# EAGLE design garden (EAGLE 9.3.2)
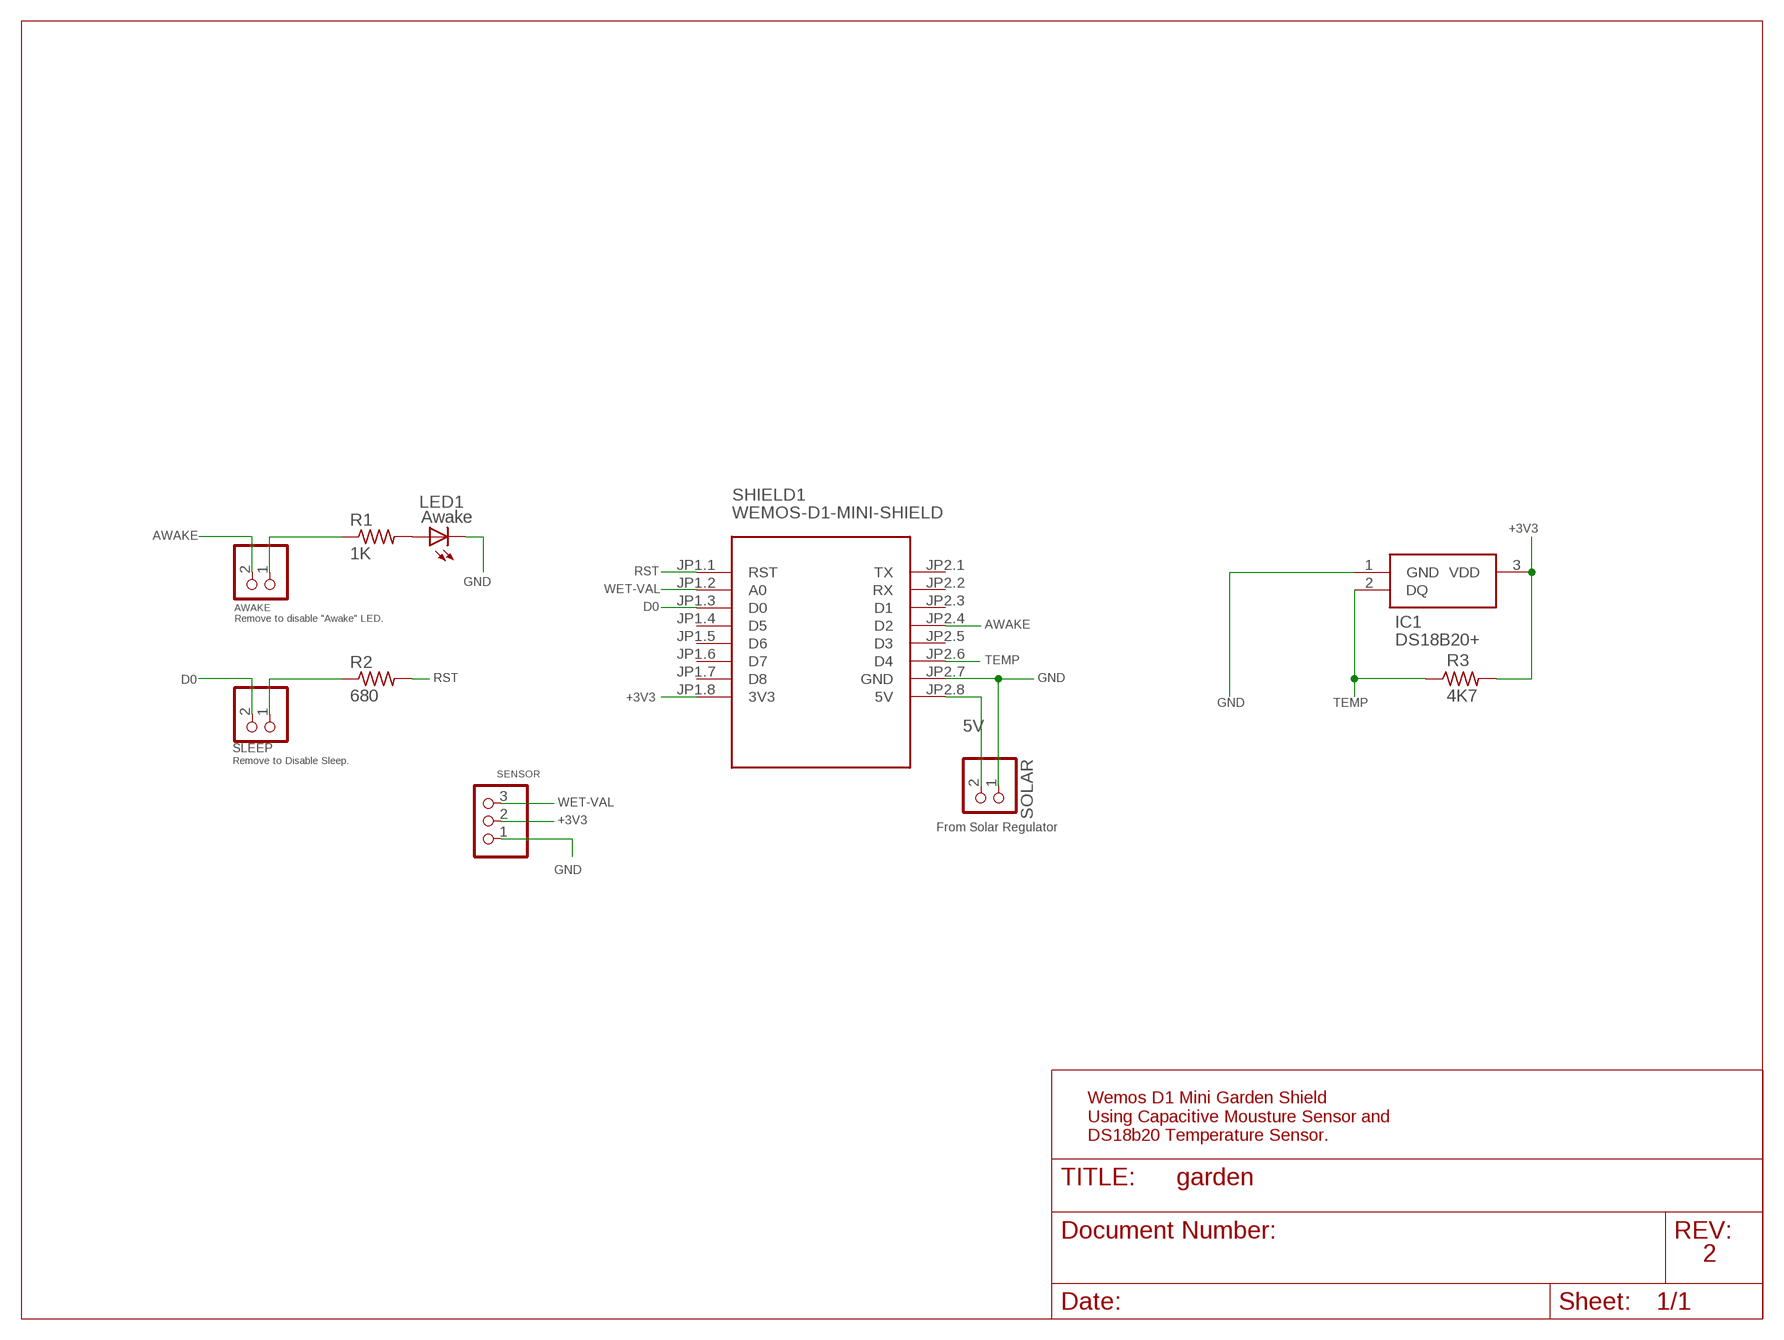
[diagram p0: schematic, sheet 1]

## Parts
AWAKE  Remove to disable "Awake" LED.  PINHD-1X2  [1X02]
IC1  DS18B20+  [TO-92]
LED1  Awake  LED3MM  [LED3MM]
R1  1K  R-US_0207/9  [0207/9]
R2  680  R-US_0207/9  [0207/9]
R3  4K7  R-US_0207/9  [0207/9]
SENSOR  Moisture Sensor  PINHD-1X3/90  [1X03/90]
SHIELD1  WEMOS-D1-MINI-SHIELD  [WEMOS-D1-MINI-SHIELD]
SLEEP  Remove to Disable Sleep.  PINHD-1X2  [1X02]
SOLAR  From Solar Regulator  PINHD-1X2/90  [1X02/90]

## Nets
5V: SHIELD1.JP2.8(5V) SOLAR.2
+3V3: IC1.3(VDD) R3.2 SENSOR.2 SHIELD1.JP1.8(3V3)
AWAKE: AWAKE.2 SHIELD1.JP2.4(D2)
D0: SHIELD1.JP1.3(D0) SLEEP.2
GND: IC1.1(GND) LED1.K(C) SENSOR.1 SHIELD1.JP2.7(GND) SOLAR.1
N$1: LED1.A R1.2
N$4: AWAKE.1 R1.1
N$6: R2.1 SLEEP.1
RST: R2.2 SHIELD1.JP1.1(RST)
TEMP: IC1.2(DQ) R3.1 SHIELD1.JP2.6(D4)
WET-VAL: SENSOR.3 SHIELD1.JP1.2(A0)
Unconnected: SHIELD1.JP1.4(D5) SHIELD1.JP1.5(D6) SHIELD1.JP1.6(D7) SHIELD1.JP1.7(D8) SHIELD1.JP2.1(TX) SHIELD1.JP2.2(RX) SHIELD1.JP2.3(D1) SHIELD1.JP2.5(D3)

## Notes on the sheet
- Wemos D1 Mini Garden Shield
  Using Capacitive Mousture Sensor and
  DS18b20 Temperature Sensor.
- 2

## Library data of the parts
AWAKE SLEEP SOLAR = DC_LOAD_AU:PINHD-1X2: PIN HEADER
IC1 = SamacSys_Parts:DS18B20+: DS18B20 prog thermometer 1-Wire, TO92 Source: Datasheet <https://componentsearchengine.com/Datasheets/1/DS18B20 .pdf>; DESCRIPTION: DS18B20 prog thermometer 1-Wire, TO92; HEIGHT: mm; MANUFACTURER_NAME: Maxim Integrated; MANUFACTURER_PART_NUMBER: DS18B20+; MOUSER_PART_NUMBER: 700-DS18B20+; MOUSER_PRICE-STOCK: https://www.mouser.com/Search/Refine.aspx?Keyword=700-DS18B20%2B
LED1 = adafruit:LED: LED OSRAM: - CHIPLED LG R971, LG N971, LY N971, LG Q971, LY Q971, LO R971, LY R971 LH N974, LH R974 LS Q976, LO Q976, LY Q976 LO Q996 - Hyper CHIPLED LW Q18S LB Q993, LB Q99A, LB R99A - SideLED LS A670, LO A670, LY A670, LG A670, LP A670 LB A673, LV A673, LT A673, LW A673 LH A674 LY A675 LS A676, LA A676, LO A676, LY A676, LW A676 LS A679, LY A679, LG A679 - Hyper Micro SIDELED® LS Y876, LA Y876, LO Y876, LY Y876 LT Y87S - SmartLED LW L88C, LW L88S LB L89C, LB L89S, LG L890 LS L89K, LO L89K, LY L89K LS L896, LA L896, LO L896, LY L896 - TOPLED LS T670, LO T670, LY T670, LG T670, LP T670 LSG T670, LSP T670, LSY T670, LOP T670, LYG T670 LG T671, LOG T671, LSG T671 LB T673, LV T673, LT T673, LW T673 LH T674 LS T676, LA T676, LO T676, LY T676, LB T676, LH T676, LSB T676, LW T676 LB T67C, LV T67C, LT T67C, LS T67K, LO T67K, LY T67K, LW E67C LS E67B, LA E67B, LO E67B, LY E67B, LB E67C, LV E67C, LT E67C LW T67C LS T679, LY T679, LG T679 LS T770, LO T770, LY T770, LG T770, LP T770 LB T773, LV T773, LT T773, LW T773 LH T774 LS E675, LA E675, LY E675, LS T675 LS T776, LA T776, LO T776, LY T776, LB T776 LHGB T686 LT T68C, LB T68C - Hyper Mini TOPLED® LB M676 - Mini TOPLED Santana® LG M470 LS M47K, LO M47K, LY M47K Source: http://www.osram.convergy.de/
R1-R3 = adafruit:R-US_: RESISTOR, American symbol
SENSOR = pinhead:PINHD-1X3: PIN HEADER
SHIELD1 = diy-modules:WEMOS-D1-MINI-SHIELD: Template for WEMOS D1 mini compatible shields NOTICE: This is a template only. You can use it as a base to create symbols for WEMOS D1 mini compatible shields. Official list of available shields can be found here: https://www.wemos.cc/D1-mini-Shields

## Board
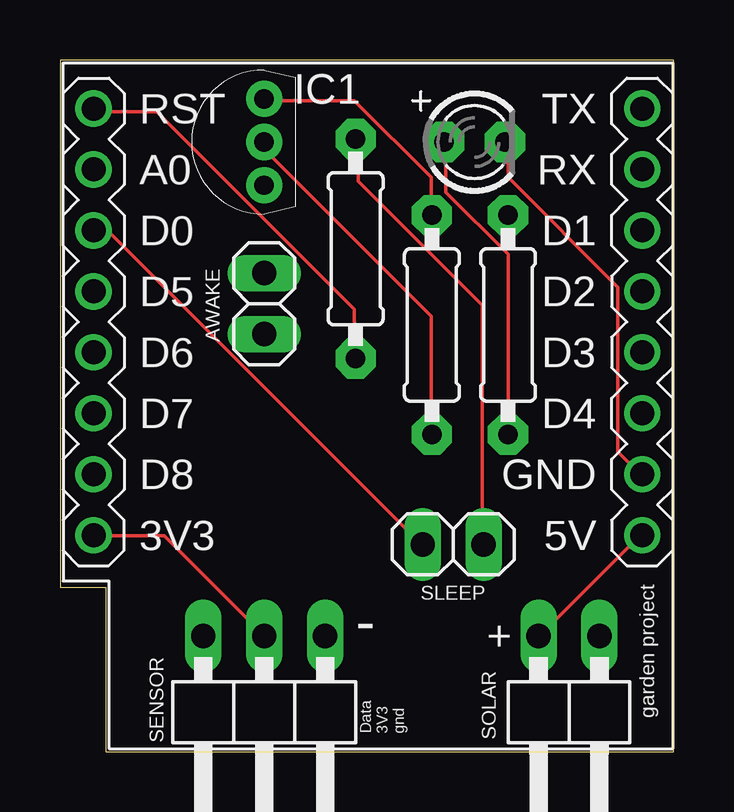
[diagram p1: board, top side]
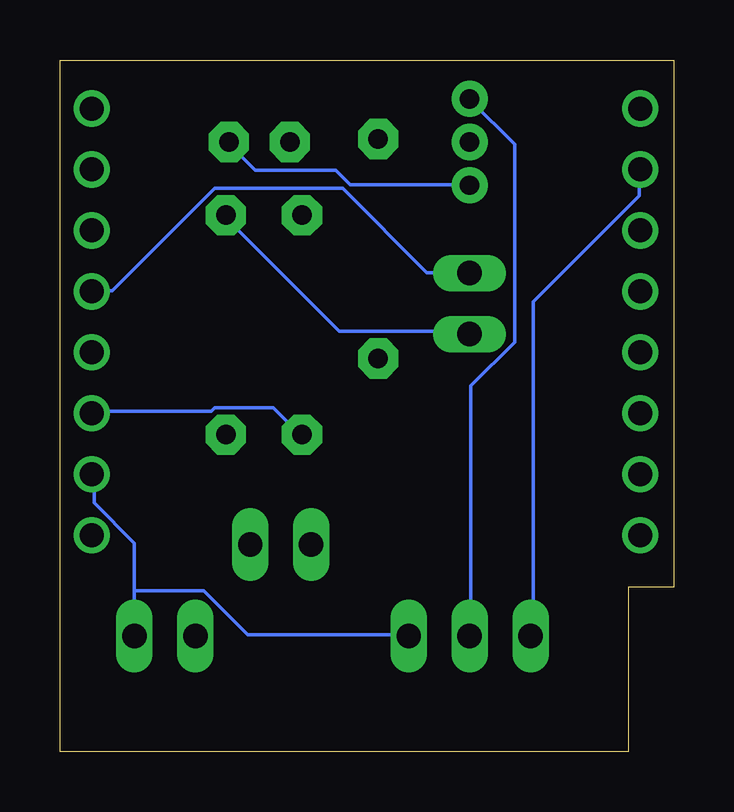
[diagram p2: board, bottom side, seen from below]

Size 25.58 x 28.82 mm. Coordinates in mm from the lower left corner, seen from the top.
Outline: 1.91,0 25.58,0 25.58,28.82 0,28.82 0,6.86 1.91,6.86 1.91,0
Copper layers (1*16): Top 0.035mm / dielectric 1.5mm / Bottom 0.035mm
Design rules "default *": minimum track width 6mil, minimum drill 0.35mm, track to track 6mil, track to pad 6mil, pad to pad 6mil, via to via 6mil, smd to smd 6mil, copper to edge 0.2mm, drill to drill 6mil, minimum pad ring 10mil, minimum via ring 8mil, stop-mask expansion 4mil, vias tented up to drill 0mil, thermal gap 10mil

### Footprints (pad centres in the part's own frame; a part is rotated, then mirrored left to right if it is on the bottom)
1X02 = drill 1.016 long: 1 -1.27,0; 2 1.27,0
TO-92 = drill 0.81 pad 1.51: 1 0,-1.8; 2 0,0; 3 0,1.8
LED3MM = drill 0.813 pad 1.676 octagon: A -1.27,0; K 1.27,0
0207/9 = drill 0.813 pad 1.676 octagon: 1 -4.572,0; 2 4.572,0
1X03/90 = drill 1.016 long: 1 -2.54,-3.81; 2 0,-3.81; 3 2.54,-3.81
WEMOS-D1-MINI-SHIELD = drill 1: JP1.1 -11.43,12.065; JP1.2 -11.43,9.525; JP1.3 -11.43,6.985; JP1.4 -11.43,4.445; JP1.5 -11.43,1.905; JP1.6 -11.43,-0.635; JP1.7 -11.43,-3.175; JP1.8 -11.43,-5.715; JP2.1 11.43,12.065; JP2.2 11.43,9.525; JP2.3 11.43,6.985; JP2.4 11.43,4.445; JP2.5 11.43,1.905; JP2.6 11.43,-0.635; JP2.7 11.43,-3.175; JP2.8 11.43,-5.715
1X02/90 = drill 1.016 long: 1 -1.27,-3.81; 2 1.27,-3.81

### Placement (x,y rotation side)
AWAKE  8.51,18.67 90 top
IC1  8.51,25.4 0 top
LED1  17.27,25.4 0 top
R1  18.67,17.78 270 top
R2  12.32,20.95 270 top
R3  15.49,17.78 90 top
SENSOR  8.51,1.02 180 top
SHIELD1  12.83,14.73 0 top
SLEEP  16.38,8.64 180 top
SOLAR  21.21,1.02 180 top

### Tracks (layer width: path | path; a pad name or v marks a point on that pad's centre or on a via)
5V
  Top 0.152: SHIELD1.JP2.8 24.16,8.99 20.04,4.88 SOLAR.2
+3V3
  Top 0.152: SENSOR.2 4.34,8.99 1.45,8.99 SHIELD1.JP1.8 | IC1.3 8.61,27.13 12.27,27.13 15.47,23.93 15.47,22.4 R3.2
  Bottom 0.152: SENSOR.2 8.46,4.88 8.46,15.24 6.63,17.07 6.63,25.3 8.46,27.13 IC1.3
AWAKE
  Bottom 0.152: SHIELD1.JP2.4 24.16,19.2 23.39,19.2 19.13,23.47 13.79,23.47 10.29,19.96 8.61,19.96 AWAKE.2
D0
  Top 0.152: SHIELD1.JP1.3 1.45,21.64 2.06,21.64 15.01,8.69 SLEEP.2
GND
  Top 0.152: LED1.K 18.67,25.3 18.67,23.93 23.24,19.36 23.24,12.5 24.16,11.58 SHIELD1.JP2.7
  Bottom 0.152: IC1.1 8.61,23.62 13.49,23.62 14.1,24.23 17.45,24.23 18.52,25.3 LED1.K | SOLAR.1 22.48,6.71 | 22.48,6.71 22.48,8.69 24.16,10.36 24.16,11.43 SHIELD1.JP2.7 | 22.48,6.71 19.58,6.71 17.75,4.88 11.05,4.88 SENSOR.1
N$1
  Top 0.152: R1.2 18.67,20.73 16.08,23.32 16.08,25.3 LED1.A
N$4
  Bottom 0.152: AWAKE.1 8.61,17.53 13.95,17.53 18.67,22.25 R1.1
N$6
  Top 0.152: SLEEP.1 17.6,8.69 17.6,18.59 12.42,23.77 12.42,25.45 R2.1
RST
  Top 0.152: SHIELD1.JP1.1 1.45,26.67 4.04,26.67 12.27,18.44 12.27,16.46 R2.2
TEMP
  Top 0.152: IC1.2 8.61,25.3 8.61,24.99 15.47,18.14 15.47,13.26 R3.1
  Bottom 0.152: SHIELD1.JP2.6 24.16,14.17 19.28,14.17 19.13,14.33 16.69,14.33 15.62,13.26 R3.1
WET-VAL
  Bottom 0.152: SHIELD1.JP1.2 1.45,24.23 1.45,23.16 5.87,18.75 5.87,4.88 SENSOR.3

### Text on the board
tPlace: - | + | Data / 3V3 / gnd | garden project